# Altium schematic sheet machine_io.SchDoc: Machine I/O
size A4; Date: 27.05.2014; Author: Stefan Lüthi; DrawnBy: Author; Organization: BFH; Address1: Bern University of Applied Sciences; Address2: Engineering and Information Technology; Address3: Jlcoweg 1; Address4: CH-3400 Burgdorf; DocumentNumber: 1; Revision: 1.0; SheetNumber: 8; SheetTotal: 8; CurrentDate: 27.05.2014
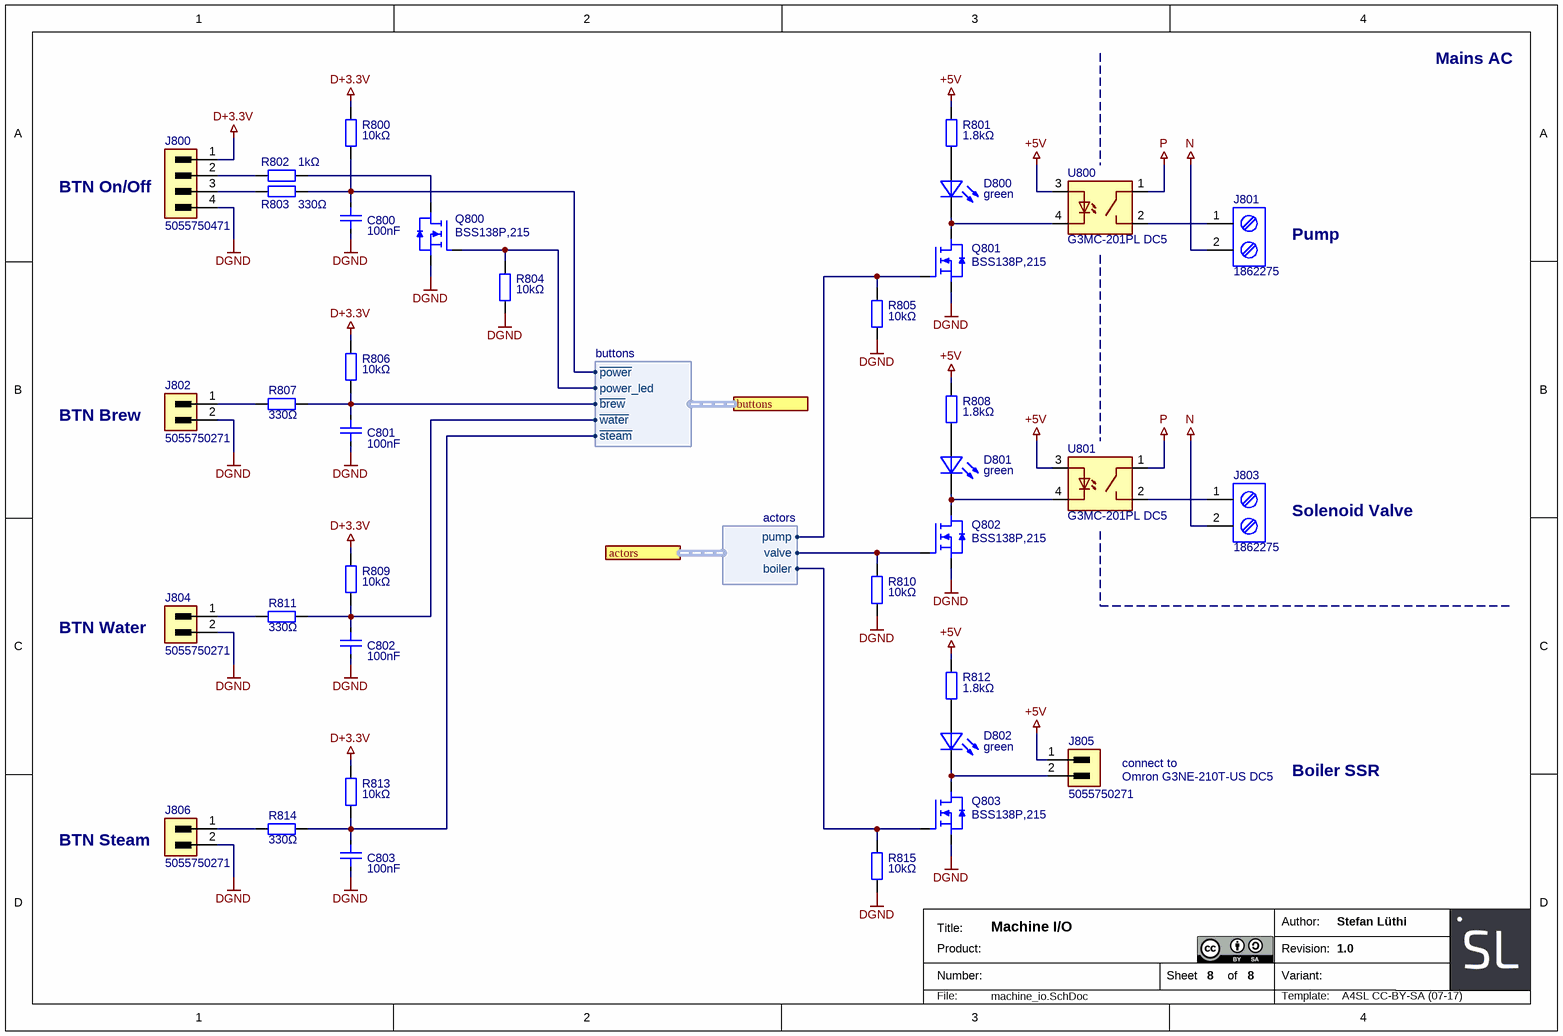
[diagram p0: machine_io.SchDoc]

## Parts
C800  100nF  [SMD0603CAP]
C801  100nF  [SMD0603CAP]
C802  100nF  [SMD0603CAP]
C803  100nF  [SMD0603CAP]
D800  green  [SMD0603LED]
D801  green  [SMD0603LED]
D802  green  [SMD0603LED]
J800  5055750471  [5055750471]
J801  1862275  [1862275]
J802  5055750271  [5055750271]
J803  1862275  [1862275]
J804  5055750271  [5055750271]
J805  5055750271  [5055750271]
J806  5055750271  [5055750271]
Q800  BSS138P,215  [SOT-23-FET]
Q801  BSS138P,215  [SOT-23-FET]
Q802  BSS138P,215  [SOT-23-FET]
Q803  BSS138P,215  [SOT-23-FET]
R800  10kΩ  [SMD0603RES]
R801  1.8kΩ  [SMD0603RES]
R802  1kΩ  [SMD0603RES]
R803  330Ω  [SMD0603RES]
R804  10kΩ  [SMD0603RES]
R805  10kΩ  [SMD0603RES]
R806  10kΩ  [SMD0603RES]
R807  330Ω  [SMD0603RES]
R808  1.8kΩ  [SMD0603RES]
R809  10kΩ  [SMD0603RES]
R810  10kΩ  [SMD0603RES]
R811  330Ω  [SMD0603RES]
R812  1.8kΩ  [SMD0603RES]
R813  10kΩ  [SMD0603RES]
R814  330Ω  [SMD0603RES]
R815  10kΩ  [SMD0603RES]
U800  G3MC-201PL DC5  [G3MC-202P]
U801  G3MC-201PL DC5  [G3MC-202P]

## Ports
actors (harness actors), buttons (harness buttons)

## Harnesses
actors: valve, pump, boiler
buttons: ~{water}, ~{brew}, ~{steam}, ~{power}, power_led

## Nets
+5V: J805.1 R801.2 R808.2 R812.2 U800.3 U801.3
D+3.3V: J800.1 R800.2 R806.2 R809.2 R813.2
DGND: C800.2 C801.2 C802.2 C803.2 J800.4 J802.2 J804.2 J806.2 Q800.S Q801.S Q802.S Q803.S R804.2 R805.2 R810.2 R815.2
N: J801.2 J803.2
P: U800.1 U801.1
NetC800_1: C800.1 R800.1 R803.1 ; port buttons.~{power}
NetC801_1: C801.1 R806.1 R807.1 ; port buttons.~{brew}
NetC802_1: C802.1 R809.1 R811.1 ; port buttons.~{water}
NetC803_1: C803.1 R813.1 R814.1 ; port buttons.~{steam}
NetD800_A: D800.A R801.1
NetD800_C: D800.C Q801.D U800.4
NetD801_A: D801.A R808.1
NetD801_C: D801.C Q802.D U801.4
NetD802_A: D802.A R812.1
NetD802_C: D802.C J805.2 Q803.D
NetJ800_2: J800.2 R802.2
NetJ800_3: J800.3 R803.2
NetJ801_1: J801.1 U800.2
NetJ802_1: J802.1 R807.2
NetJ803_1: J803.1 U801.2
NetJ804_1: J804.1 R811.2
NetJ806_1: J806.1 R814.2
NetQ800_D: Q800.D R802.1
NetQ800_G: Q800.G R804.1 ; port buttons.power_led
NetQ801_G: Q801.G R805.1 ; port actors.pump
NetQ802_G: Q802.G R810.1 ; port actors.valve
NetQ803_G: Q803.G R815.1 ; port actors.boiler

## Notes on the sheet
- Mains AC
- (near J800) BTN On/Off
- Pump
- BTN Brew
- Solenoid Valve
- BTN Water
- (near J805) connect to
  Omron G3NE-210T-US DC5
- Boiler SSR
- BTN Steam
- Author:
- Title:
- Number:
- Product:
- Sheet
- of
- Variant:
- Revision:
- File:
- Template:
- A4SL CC-BY-SA (07-17)

## Library data of the parts
C800-C803 = Capacitor Ceramic: Ceramic Capacitor
D800-D802 = LED
J800 = Connector 4x1P
J801 J803 = 1862275: Screw Terminal, 2 Position, 5mm Spacing
J802 J804-J806 = Connector 2x1P
Q800-Q803 = NMOS: NMOS Transistor
R800-R815 = Resistor
U800 U801 = OptoMOS SSR: OptoMOS Solid State Relay